# EAGLE schematic ultimatedrive2 (EAGLE 9.6.0)
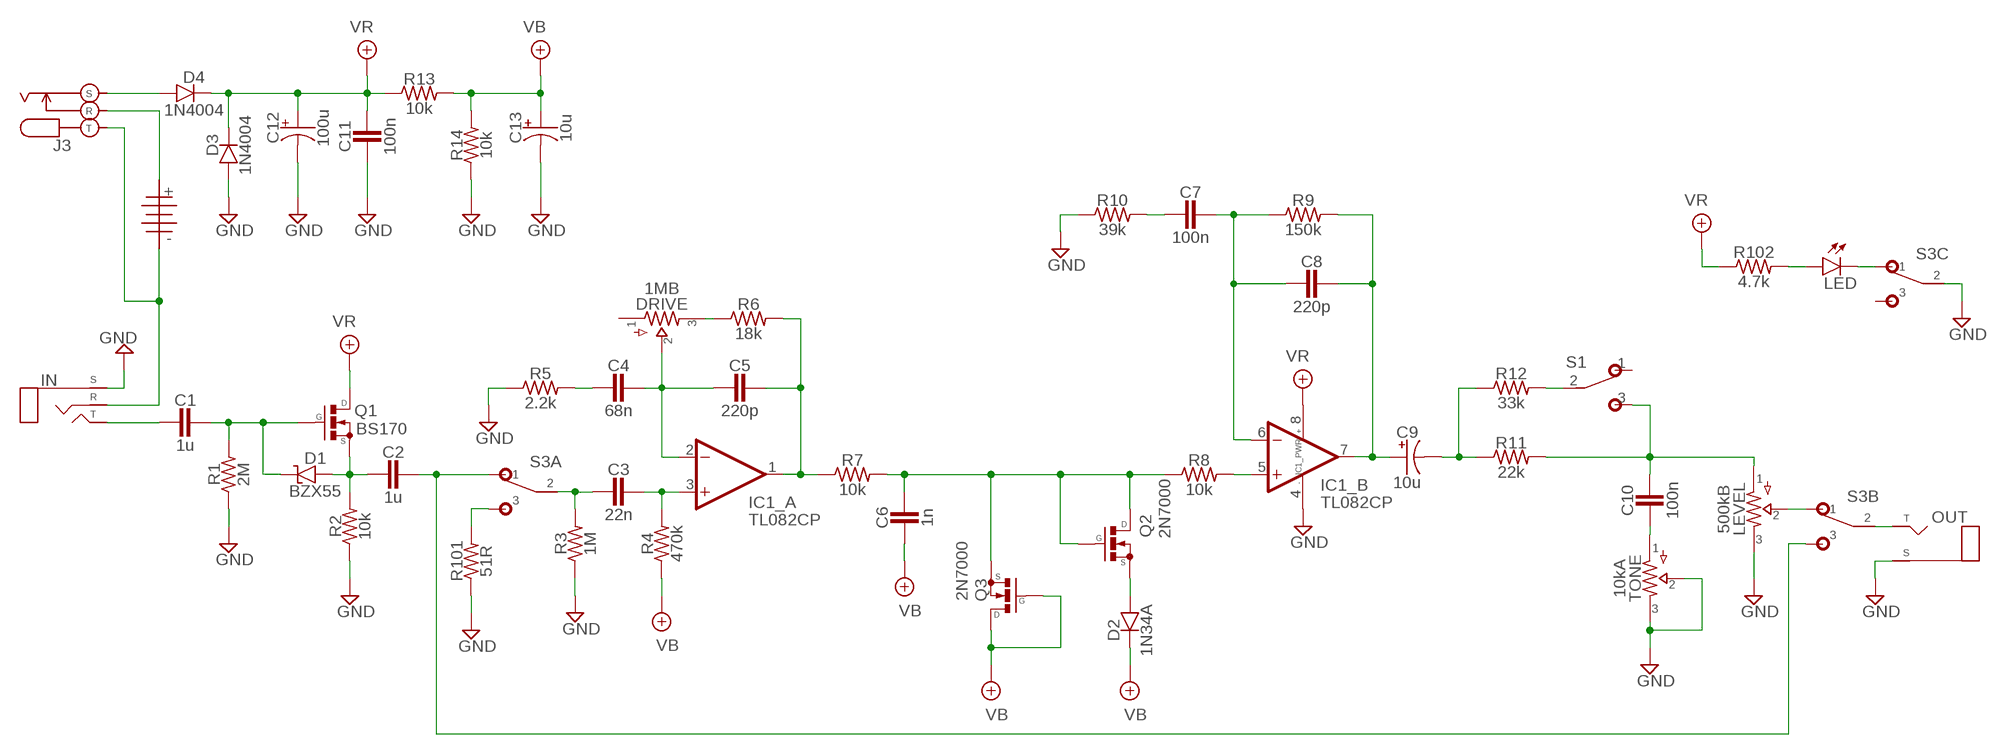
[diagram p0: schematic, sheet 1]

## Parts
1  BATTERY  [TWO_PADS]
C1  1u  CER/FILMBOX.1  [BOX_SMALL]
C2  1u  CER/FILMBOX.1  [BOX_SMALL]
C3  22n  CER/FILMBOX.1  [BOX_SMALL]
C4  68n  CER/FILMBOX.1  [BOX_SMALL]
C5  220p  CER/FILMBOX.1  [BOX_SMALL]
C6  1n  CER/FILMBOX.1  [BOX_SMALL]
C7  100n  CER/FILMBOX.1  [BOX_SMALL]
C8  220p  CER/FILMBOX.1  [BOX_SMALL]
C9  10u  0500  [050_020]
C10  100n  CER/FILMBOX.1  [BOX_SMALL]
C11  100n  CER/FILMBOX.1  [BOX_SMALL]
C12  100u  0500  [050_020]
C13  10u  0500  [050_020]
D1  BZX55  ZENER.3  [DO41-3]
D2  1N34A  DO41.2  [DO41-2]
D3  1N4004  DO41.3  [DO41-3]
D4  1N4004  DO41.3  [DO41-3]
DRIVE  1MB  POTS16MM  [16MM]
IC1  TL082CP  DUALTH  [DIL0]
IN  STEREO  [STEREO_PCB]
J3  DC_KOBICONN  [DC_KOBICONN]
LED  LED  [3MM_D]
LEVEL  500kB  POTS16MM  [16MM]
OUT  MONO  [TWO_PADS]
Q1  BS170  [SOT54ES]
Q2  2N7000  [TO92-]
Q3  2N7000  [TO92-]
R1  2M  R_.3B  [R0207/3]
R2  10k  R_.3B  [R0207/3]
R3  1M  R_.3B  [R0207/3]
R4  470k  R_.3B  [R0207/3]
R5  2.2k  R_.3B  [R0207/3]
R6  18k  R_.3B  [R0207/3]
R7  10k  R_.3B  [R0207/3]
R8  10k  R_.3B  [R0207/3]
R9  150k  R_.3B  [R0207/3]
R10  39k  R_.3B  [R0207/3]
R11  22k  R_.3B  [R0207/3]
R12  33k  R_.3B  [R0207/3]
R13  10k  R_.3B  [R0207/3]
R14  10k  R_.3B  [R0207/3]
R101  51R  R_.3B  [R0207/3]
R102  4.7k  R_.3B  [R0207/3]
S1  SPDT  [M9040P]
S3  3PDT  [3PDT]
TONE  10kA  POTS16MM  [16MM]

## Nets
GND: C11.2 C12.- C13.- D3.A IC1.4(_PWR:V-) IN.P$1(S) LEVEL.3 OUT.S(SLEEVE) R1.1 R2.1 R3.1 R5.1 R10.1 R14.1 R101.1 S3.C2 TONE.2 TONE.3
N$1: C9.- R11.1 R12.1
N$2: C10.2 TONE.1
N$3: C3.2 R3.2 S3.A2
N$4: C3.1 IC1.3(_A:+IN) R4.2
N$5: C4.1 C5.2 DRIVE.2 IC1.2(_A:-IN)
N$6: DRIVE.3 R6.1
N$7: C5.1 IC1.1(_A:OUT) R6.2 R7.1
N$8: C4.2 R5.2
N$9: IC1.5(_B:+IN) R8.2
N$10: D2.A Q2.3(S)
N$11: C6.1 Q2.1(D) Q2.2(G) Q3.3(S) R7.2 R8.1
N$12: C7.1 C8.2 IC1.6(_B:-IN) R9.1
N$13: C8.1 C9.+ IC1.7(_B:OUT) R9.2
N$14: C7.2 R10.2
N$15: R12.2 S1.2(P)
N$16: C10.1 LEVEL.1 R11.2 S1.3(S)
N$17: D4.A J3.S
N$18: 1.T J3.R
N$19: 1.S IN.P$2(R) J3.T
N$20: C1.2 IN.P$3(T)
N$21: C1.1 D1.C Q1.G R1.2
N$22: R101.2 S3.A3
N$23: C2.2 D1.A Q1.S R2.2
N$24: C2.1 S3.A1 S3.B3
N$25: LEVEL.2 S3.B1
N$26: OUT.T(TIP) S3.B2
N$27: LED.ANODE(A) R102.2
N$28: LED.P$1(C) S3.C1
VB: C6.2 C13.+ D2.C Q3.1(D) Q3.2(G) R4.1 R13.2 R14.2
VR: C11.1 C12.+ D3.C D4.C IC1.8(_PWR:V+) Q1.D R13.1 R102.1
Unconnected: DRIVE.1 S1.1(O) S3.C3

## Library data of the parts
1 = pedals-jacks:BATTERY
C1-C8 C10 C11 = pedals-capacitors-film:CER/FILM: 47 - 120pF Xicon Ceramic Disc 2.5mm lead spacing
C9 C12 C13 = pedals-capacitors-elec:050
D1 = pedals-diodes:ZENER
D2-D4 = pedals-diodes:DO41: DO-41 Package Diodes: 1N4001 - 1N40019 Zener Diodes: 1N4728 - 1N4764
DRIVE LEVEL TONE = pedals-potentiometers:POTS
IC1 = pedals-integrated circuits:DUAL: OP AMP
IN = pedals-jacks:STEREO
J3 = pedals-jacks:DC_KOBICONN
LED = pedals-diodes:LED
OUT = pedals-jacks:MONO: Mono 1/4" Phone Jack
Q1 = pedals-transistors:BS170: N-CHANNEL MOS FET
Q2 Q3 = pedals-transistors:2N7000
R1-R14 R101 R102 = pedals-resistors:R_
S1 = pedals-switches:SPDT: TOGGLE SWITCH Marquardt
S3 = pedals-switches:3PDT